# Altium schematic sheet 1_P1.schdoc.schdoc
size 309 x 223 mm; Symbol: sheet-symbol_a4; Device: Sheet-Symbol_A4; Company: 嘉立创EDA; Version: V1.0; Page Size: A4; @Project Name: BAKA_32S; @Page Count: 1; @Update Date: 2024-06-26; @Create Date: 2024-06-26; @Schematic Name: Schematic1_1; @Page No: 1; @Page Name: P1
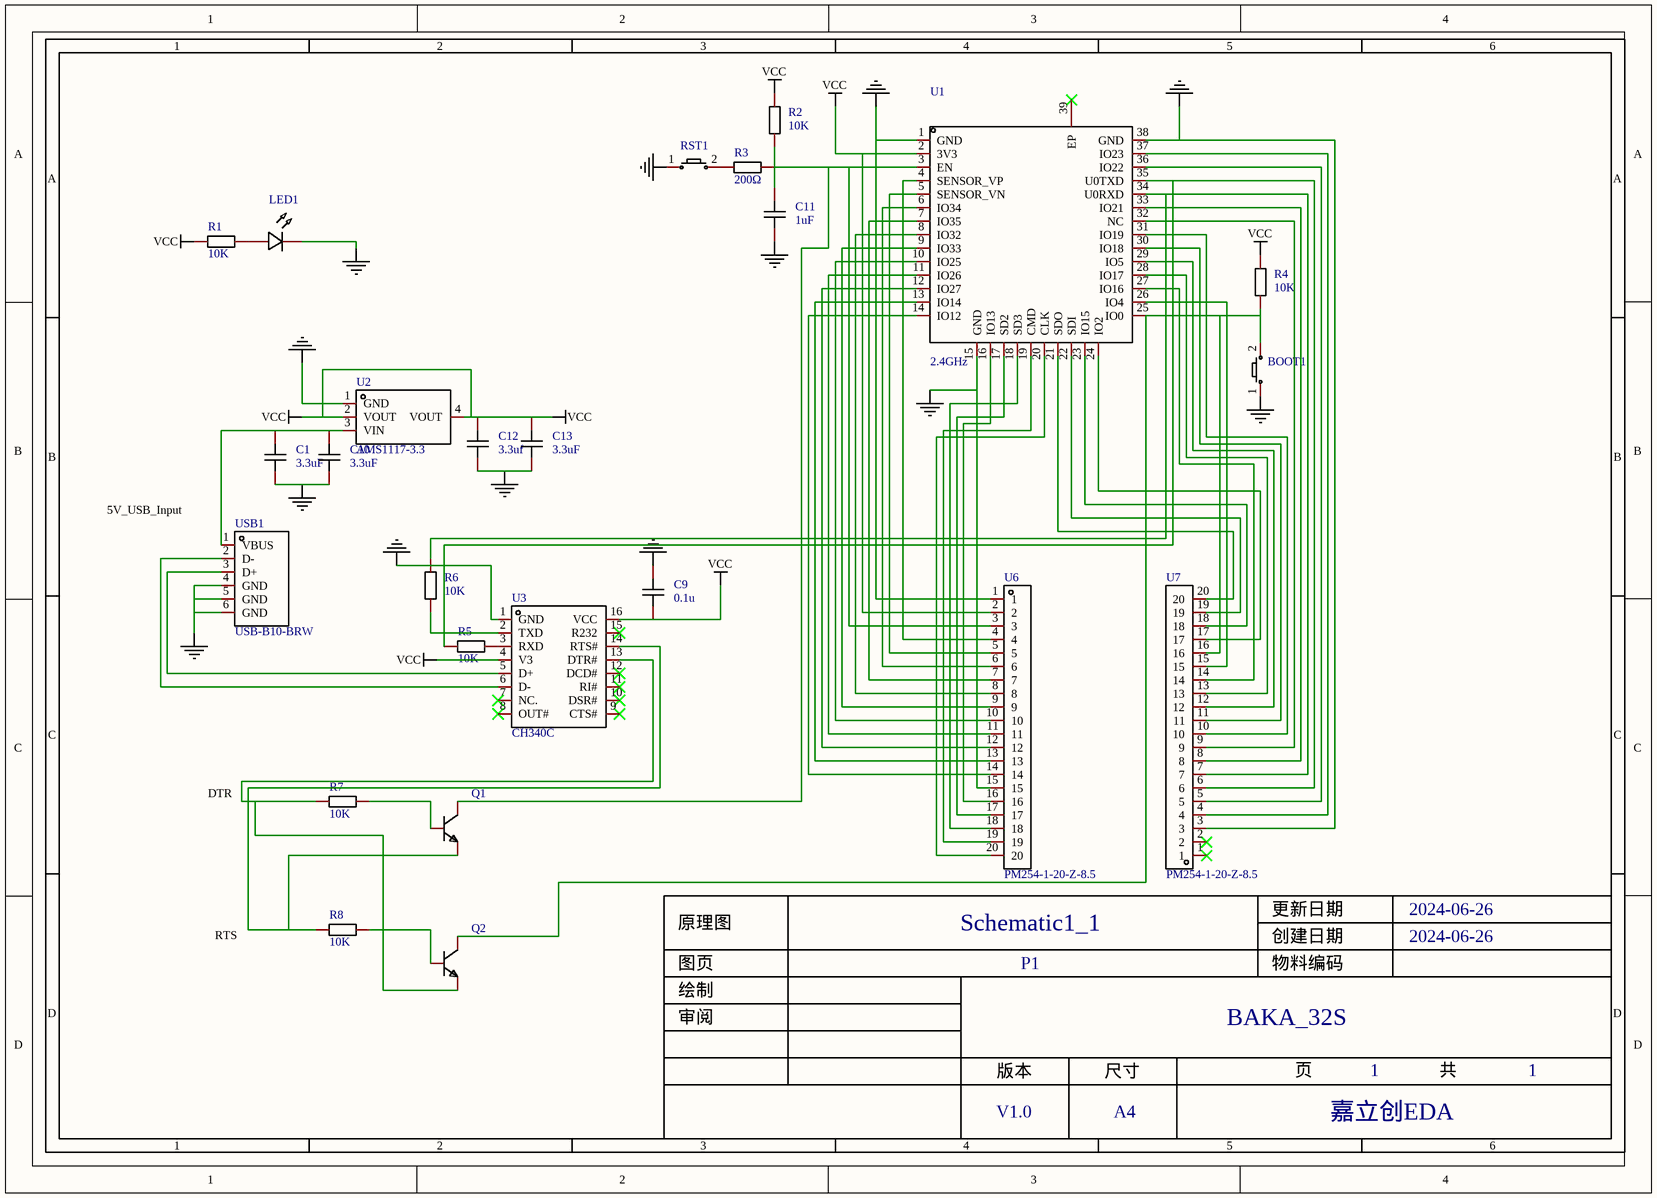
[diagram p0: 1_P1.schdoc.schdoc]

## Parts
BOOT1  Key_SMD_3x4x2  [Key_SMD_3x4x2]  (value not drawn)
C1  3.3uF  [C0603]
C9  0.1u  [C0603]
C10  3.3uF  [C0603]
C11  1uF  [C0603]
C12  3.3uf  [C0603]
C13  3.3uF  [C0603]
LED1  LED_0603-R  [LED_0603]  (value not drawn)
Q1  S8050_SOT_NPN  [S8050_SOT-23]  (value not drawn)
Q2  S8050_SOT_NPN  [S8050_SOT-23]  (value not drawn)
R1  10K  [R0603]
R2  10K  [R0603]
R3  200Ω  [R0603]
R4  10K  [R0603]
R5  10K  [R0603]
R6  10K  [R0603]
R7  10K  [R0603]
R8  10K  [R0603]
RST1  Key_SMD_3x4x2  [Key_SMD_3x4x2]  (value not drawn)
U1  2.4GHz  [WIRELM-SMD_ESP32-S]
U2  AMS1117-3.3  [SOT-223-3_L6.5-W3.4-P2.30-LS7.0-BR]
U3  CH340C  [SOP-16_L10.0-W3.9-P1.27-LS6.0-BL]
U6  PM254-1-20-Z-8.5  [HDR-TH_20P-P2.54-V-F-2]
U7  PM254-1-20-Z-8.5  [HDR-TH_20P-P2.54-V-F-2]
USB1  USB-B10-BRW  [USB-B-TH_USB-B10-BRW]

## Nets
GND: BOOT1.1 C1.1 C9.2 C10.1 C11.1 C12.1 C13.1 LED1.1(C) RST1.1 U1.1(GND) U1.15(GND) U1.38(GND) U2.1(GND) U3.1(GND) U6.1 U6.15 U7.3 USB1.4(GND) USB1.5(GND) USB1.6(GND)
VCC: C9.1 C12.2 C13.2 R1.1 R2.2 R4.2 U1.2(3V3) U2.2(VOUT) U2.4(VOUT) U3.4(V3) U3.16(VCC) U6.2
NetBOOT1_2: BOOT1.2 Q2.3 R4.1 U1.25(IO0) U7.16
NetC1_2: C1.2 C10.2 U2.3(VIN) USB1.1(VBUS)
NetC11_2: C11.2 Q1.3 R2.1 R3.2 U1.3(EN) U6.3
NetLED1_2: LED1.2(A) R1.2
NetQ1_1: Q1.1 R7.2
NetQ1_2: Q1.2 R8.1 U3.14(RTS#)
NetQ2_1: Q2.1 R8.2
NetQ2_2: Q2.2 R7.1 U3.13(DTR#)
NetR3_1: R3.1 RST1.2
NetR5_1: R5.1 U1.35(U0TXD) U7.6
NetR5_2: R5.2 U3.3(RXD)
NetR6_1: R6.1 U3.2(TXD)
NetR6_2: R6.2 U1.34(U0RXD) U7.7
NetU1_4: U1.4(SENSOR_VP) U6.4
NetU1_5: U1.5(SENSOR_VN) U6.5
NetU1_6: U1.6(IO34) U6.6
NetU1_7: U1.7(IO35) U6.7
NetU1_8: U1.8(IO32) U6.8
NetU1_9: U1.9(IO33) U6.9
NetU1_10: U1.10(IO25) U6.10
NetU1_11: U1.11(IO26) U6.11
NetU1_12: U1.12(IO27) U6.12
NetU1_13: U1.13(IO14) U6.13
NetU1_14: U1.14(IO12) U6.14
NetU1_16: U1.16(IO13) U6.16
NetU1_17: U1.17(SD2) U6.17
NetU1_18: U1.18(SD3) U6.18
NetU1_19: U1.19(CMD) U6.19
NetU1_20: U1.20(CLK) U6.20
NetU1_21: U1.21(SDO) U7.20
NetU1_22: U1.22(SDI) U7.19
NetU1_23: U1.23(IO15) U7.18
NetU1_24: U1.24(IO2) U7.17
NetU1_26: U1.26(IO4) U7.15
NetU1_27: U1.27(IO16) U7.14
NetU1_28: U1.28(IO17) U7.13
NetU1_29: U1.29(IO5) U7.12
NetU1_30: U1.30(IO18) U7.11
NetU1_31: U1.31(IO19) U7.10
NetU1_32: U1.32(NC) U7.9
NetU1_33: U1.33(IO21) U7.8
NetU1_36: U1.36(IO22) U7.5
NetU1_37: U1.37(IO23) U7.4
NetU3_5: U3.5(D+) USB1.3(D+)
NetU3_6: U3.6(D-) USB1.2(D-)

Not connected (* = marked no-connect by the designer): U1 39(EP)*; U3 7(NC.)* 8(OUT#)* 9(CTS#)* 10(DSR#)* 11(RI#)* 12(DCD#)* 15(R232)*; U7 1* 2*

## Notes on the sheet
- 5V_USB_Input
- DTR
- RTS
- 1
- 2
- 3
- 4
- 5
- 6
- A
- B
- C
- 原理图
- Schematic1_1
- 创建日期
- 更新日期
- 2024-06-26
- D
- 审阅
- 绘制
- 图页
- P1
- 物料编码
- BAKA_32S
- 版本
- 尺寸
- 页
- 共
- V1.0
- A4
- 嘉立创EDA

## Library data of the parts
BOOT1 RST1 = Key_SMD_3x4x2: Symbol: 轻触按键x2; Convert to PCB: yes; Device: Key_SMD_3x4x2; Add into BOM: yes; Supplier Footprint: SMD
C1 C9-C13 = CAP_0603: Symbol: CapAcitance; Convert to PCB: yes; Device: CAP_0603; Add into BOM: yes; Supplier Footprint: 0603
  C1 C10 C13: Name: 3.3uF; Value: 3.3uF
  C9: Name: 0.1u; Value: 0.1u
  C11: Name: 1uF; Value: 1uF
  C12: Name: 3.3uf; Value: 3.3uf
LED1 = LED_0603-R: Symbol: LED_R; Convert to PCB: yes; Device: LED_0603-R; Add into BOM: yes; Supplier Footprint: 0603
Q1 Q2 = S8050_SOT_NPN: Symbol: NPN; Convert to PCB: yes; Device: S8050_SOT_NPN; Add into BOM: yes; Supplier Footprint: SOT-23
R1-R8 = Res_0603: Symbol: 电阻; Convert to PCB: yes; Device: Res_0603; Add into BOM: yes; Supplier Footprint: 0603
  R1 R2 R4-R8: Name: 10K; Value: 10K
  R3: Name: 200Ω; Value: 200Ω
U1 = ESP32-S: Manufacturer: Ai-Thinker(安信可); Add into BOM: yes; Core Processor: ESP32芯片; Support Interface: I2C；UART；DAC；SPI；PWM；ADC; Antenna Type: IPEX接口; Output Power: 17dBm; Operating Voltage: 3.3V; Sensitivity: -90dBm; Description: 核心处理器:ESP32芯片;频率:2.4GHz;天线形式:IPEX接口;发射功率:17dBm;接收灵敏度:-90dBm;; Name: 2.4GHz; Symbol: ESP32-S; Device: ESP32-S; LCSC Part Name: ESP32-S; Supplier Part: C277944; Manufacturer Part: ESP32-S; Supplier Footprint: SMD; JLCPCB Part Class: 扩展库; Datasheet: https://atta.szlcsc.com/upload/public/pdf/source/20211217/F4BEA33E732D6002D10DAED85BBCB52B.pdf; Supplier: LCSC; Convert to PCB: yes; Wireless Standard: -; Value: 2.4GHz; Receive  Current: -; Send  Current: -; Operating Temperature: -40℃~+85℃
U2 = AMS1117-3.3_C6186: Manufacturer: AMS; Add into BOM: yes; Output Type: 固定; Output Voltage: 3.3V; MAX Output Current: 1A; Power Supply Rejection Ratio (PSRR): 72dB@(120Hz); Dropout Voltage: 1.3V@(800mA); Output Polarity: 正极; Number of Outputs: 1; Description: 输出类型:固定;最大输入电压:-;输出电压:3.3V;最大输出电流:1A;电源纹波抑制比(PSRR):72dB@(120Hz);输出极性:正极;; Name: AMS1117-3.3; Symbol: AMS1117-3.3; Device: AMS1117-3.3_C6186; LCSC Part Name: 输出3.3V 1A; Supplier Part: C6186; Manufacturer Part: AMS1117-3.3; Supplier Footprint: SOT-223; JLCPCB Part Class: 基础库; Datasheet: https://atta.szlcsc.com/upload/public/pdf/source/20180727/C6186_7A095716F0823C02F1997A905E26C086.pdf; Supplier: LCSC; Convert to PCB: yes; Maximum Input Voltage: -; standby current: -; Noise: -; Feature: -; Operating Temperature: -
U3 = CH340C: Manufacturer: WCH(南京沁恒); Add into BOM: yes; Applications Function: 收发器; Protocol: USB 2.0; Supply Voltage: 3.3V；5V; Data Rate: 2Mbps; Description: 应用功能:收发器;接口协议:USB 2.0;数据速率:2Mbps;; Name: CH340C; Symbol: CH340C; Device: CH340C; Supplier: LCSC; Manufacturer Part: CH340C; Supplier Part: C84681; JLCPCB Part Class: 扩展库; LCSC Part Name: CH340C USB转串口芯片 CH340; Supplier Footprint: SOP-16; Datasheet: https://atta.szlcsc.com/upload/public/pdf/source/20200819/C84681_ADBED554CE321879DBD6B1D06488689C.pdf; Convert to PCB: yes
U6 U7 = PM254-1-20-Z-8.5: Manufacturer: HCTL(华灿天禄); Add into BOM: yes; Holes Structure: 1x20P; Pitch: 2.54mm; Circular Hole / Square Hole: 方孔; Number of Holes: 20P; Current Rating (Max): 3A; Holes Direction: 顶部; Soldering Temperature(Max): 260℃@5S; Description: 插孔结构:1x20P;间距:2.54mm;行距:-;圆孔/方孔:方孔;安装类型:直插;排数:单排;总孔位数:20P;额定电流:3A;额定电压:-;插孔方向:顶部;塑高:8.5mm;触头材质:铜合金;工作温度范围:-40℃~+105℃;焊接温度(最大值):260℃@5S;; Name: PM254-1-20-Z-8.5; Symbol: PM254-1-20-Z-8.5; Device: PM254-1-20-Z-8.5; LCSC Part Name: 1x20P 间距:2.54mm 直插; Supplier Part: C2897383; Manufacturer Part: PM254-1-20-Z-8.5; Supplier Footprint: 插件,P=2.54mm; JLCPCB Part Class: 扩展库; Datasheet: https://atta.szlcsc.com/upload/public/pdf/source/20230609/534BE42964C679BDE98E061007C4ABD6.pdf; Supplier: LCSC; Convert to PCB: yes; Row Spacing: -; Mounting Type: 直插; Number of Rows: 单排; Voltage Rating (Max): -; Insulation Height: 8.5mm; Contact Material: 铜合金; Operating Temperature Range: -40℃~+105℃
USB1 = USB-B10-BRW: Manufacturer: XUNPU(讯普); Add into BOM: yes; Connector Type: Type-B; Gender: 母; Number of Ports: 1; Number of Contacts: 4P; Current Rating - Power (Max): 1.5A; Soldering Temperature(Max): 260℃; Description: 连接器类型:Type-B;标准:USB 2.0;公母:母;端口数量:1;触点数量:4P;安装方式:弯插;额定电流 - 电源:1.5A;工作温度范围:-20℃~+70℃;焊接温度(最大值):260℃;; Name: USB-B10-BRW; Symbol: USB-B10-BRW; Device: USB-B10-BRW; LCSC Part Name: Type-B 母 弯插; Supplier Part: C720549; Manufacturer Part: USB-B10-BRW; Supplier Footprint: 插件; JLCPCB Part Class: 扩展库; Datasheet: https://atta.szlcsc.com/upload/public/pdf/source/20200812/C720549_53E9294752E2933874870440E626C579.pdf; Supplier: LCSC; Convert to PCB: yes; Standard: USB 2.0; Mounting Style: 弯插; Operating Temperature Range: -20℃~+70℃